# Altium project BRIDGE_RECTIFIER.PrjPcb
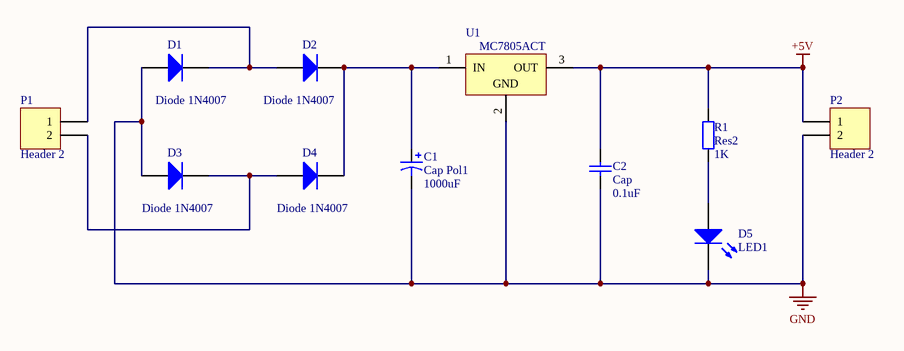
[diagram p0: BRIDGE_RECTIFIER.SchDoc]
1 sheet, 11 parts. Net scope: global (net labels, ports and power ports of the same name join across sheets).
Board file: BRIDGE_RECTIFIER_01.PcbDoc

## Sheet BRIDGE_RECTIFIER.SchDoc
size A4

### Parts
C1  Cap Pol1  value 1000uF  [RB7.6-15]
C2  Cap  value 0.1uF  [RAD-0.3]
D1  Diode 1N4007  [DIO10.46-5.3x2.8]
D2  Diode 1N4007  [DIO10.46-5.3x2.8]
D3  Diode 1N4007  [DIO10.46-5.3x2.8]
D4  Diode 1N4007  [DIO10.46-5.3x2.8]
D5  LED1  [LED-1]
P1  Header 2  [HDR1X2]
P2  Header 2  [HDR1X2]
R1  Res2  value 1K  [AXIAL-0.4]
U1  MC7805ACT  [221A-04]

### Nets
+5V: C2.2 P2.1 R1.2 U1.3(OUT)
GND: C1.2 C2.1 D1.1(A) D3.1(A) D5.2(K) P2.2 U1.2(GND)
NetC1_1: C1.1 D2.2(K) D4.2(K) U1.1(IN)
NetD1_2: D1.2(K) D2.1(A) P1.1
NetD3_2: D3.2(K) D4.1(A) P1.2
NetD5_1: D5.1(A) R1.1

### Library data of the parts
C1 = Cap Pol1: Polarized Capacitor (Radial); Published: 8-Jun-2000; LatestRevisionDate: 17-Jul-2002; LatestRevisionNote: Re-released for DXP Platform.; PackageReference: RB7.6-15; Publisher: Altium Limited
C2 = Cap: Capacitor; Published: 8-Jun-2000; LatestRevisionDate: 17-Jul-2002; LatestRevisionNote: Re-released for DXP Platform.; PackageReference: RAD-0.3; Publisher: Altium Limited
D1-D4 = Diode 1N4007: 1 Amp General Purpose Rectifier; Published: 8-Jun-2000; LatestRevisionDate: 17-Jul-2002; LatestRevisionNote: Re-released for DXP Platform.; DatasheetVersion: 1998; PackageVersion: Aug-1999; PackageReference: DO-41; Publisher: Altium Limited; Code_JEDEC: DO-204-AL; ComponentLink1Description: Manufacturer Link; ComponentLink1URL: http://www.fairchildsemi.com/; ComponentLink2Description: Datasheet; ComponentLink2URL: http://www.fairchildsemi.com/ds/1N%2F1N4001.pdf
D5 = LED1: Typical RED GaAs LED; Published: 8-Jun-2000; LatestRevisionDate: 08-Jul-2005; LatestRevisionNote: Mech Layer 1 removed.; PackageReference: LED-1; Publisher: Altium Limited
P1 P2 = Header 2: Header, 2-Pin; LatestRevisionDate: 17-Jul-2002; LatestRevisionNote: Re-released for DXP Platform.; Publisher: Altium Limited
R1 = Res2: Resistor; Published: 8-Jun-2000; LatestRevisionDate: 17-Jul-2002; LatestRevisionNote: Re-released for DXP Platform.; PackageReference: AXIAL-0.4; Publisher: Altium Limited
U1 = MC7805ACT: 3-Terminal Positive Fixed Voltage Regulator; Note: Pin 2 is electrically connected to TAB; Published: 17-Jul-2002; DatasheetVersion: 1988; PackageReference: 221A-04; Publisher: Altium Limited; PackageDescription: TO, Thru-Hole, Vertical, Heatsink Mounted; 3 In-Line Leads; Pitch 2.54 mm; Code_JEDEC: TO-262-AA; ComponentLink1Description: Manufacturer Link; ComponentLink1URL: http://www.onsemi.com/site/products/taxonomy/0,4438,503,00.html; ComponentLink2Description: Datasheet; ComponentLink2URL: http://www.onsemi.com/pub/Collateral/MC7800-D.PDF